# EAGLE schematic odrb (EAGLE 9.6.0)
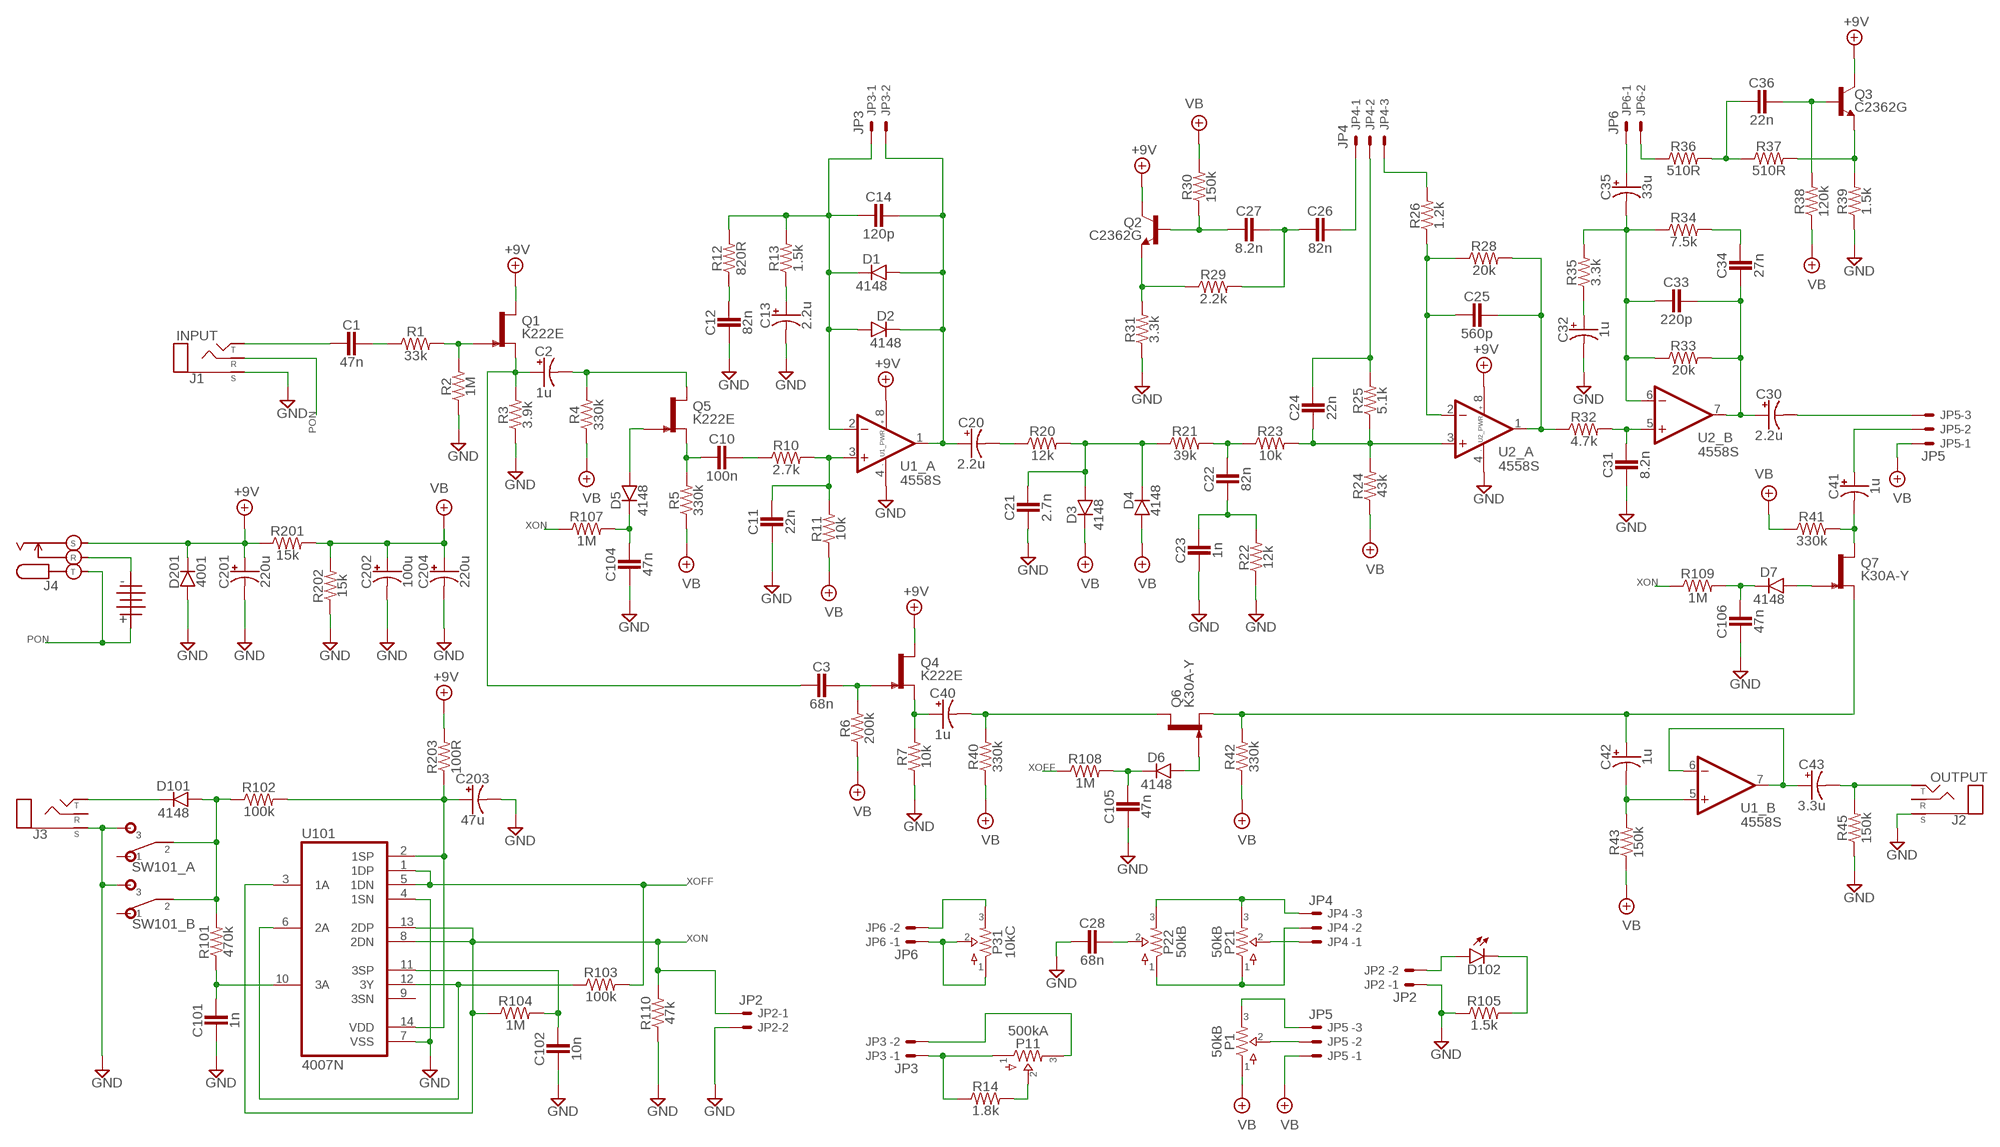
[diagram p0: schematic, sheet 1]

## Parts
1  BATTERY  [TWO_PADS]
C1  47n  CER/FILMBOX.1  [BOX_SMALL]
C2  1u  0400  [040_020]
C3  68n  CER/FILMBOX.1  [BOX_SMALL]
C10  100n  CER/FILMBOX.1  [BOX_SMALL]
C11  22n  CER/FILMBOX.1  [BOX_SMALL]
C12  82n  CER/FILMBOX.1  [BOX_SMALL]
C13  2.2u  0400  [040_020]
C14  120p  CER/FILMBOX.1  [BOX_SMALL]
C20  2.2u  0400  [040_020]
C21  2.7n  CER/FILMBOX.1  [BOX_SMALL]
C22  82n  CER/FILMBOX.1  [BOX_SMALL]
C23  1n  CER/FILMBOX.1  [BOX_SMALL]
C24  22n  CER/FILMBOX.1  [BOX_SMALL]
C25  560p  CER/FILMBOX.1  [BOX_SMALL]
C26  82n  CER/FILMBOX.1  [BOX_SMALL]
C27  8.2n  CER/FILMBOX.1  [BOX_SMALL]
C28  68n  CER/FILMBOX.1  [BOX_SMALL]
C30  2.2u  0400  [040_020]
C31  8.2n  CER/FILMBOX.1  [BOX_SMALL]
C32  1u  0400  [040_020]
C33  220p  CER/FILMBOX.1  [BOX_SMALL]
C34  27n  CER/FILMBOX.1  [BOX_SMALL]
C35  33u  0400  [040_020]
C36  22n  CER/FILMBOX.1  [BOX_SMALL]
C40  1u  0400  [040_020]
C41  1u  0400  [040_020]
C42  1u  0400  [040_020]
C43  3.3u  0400  [040_020]
C101  1n  CER/FILMBOX.1  [BOX_SMALL]
C102  10n  CER/FILMBOX.1  [BOX_SMALL]
C104  47n  CER/FILMBOX.1  [BOX_SMALL]
C105  47n  CER/FILMBOX.1  [BOX_SMALL]
C106  47n  CER/FILMBOX.1  [BOX_SMALL]
C201  220u  0400  [040_020]
C202  100u  0400  [040_020]
C203  47u  0400  [040_020]
C204  220u  0400  [040_020]
D1  4148  DO35.2  [DO35-2]
D2  4148  DO35.2  [DO35-2]
D3  4148  DO35.2  [DO35-2]
D4  4148  DO35.2  [DO35-2]
D5  4148  DO35.2  [DO35-2]
D6  4148  DO35.2  [DO35-2]
D7  4148  DO35.2  [DO35-2]
D101  4148  DO35.2  [DO35-2]
D102  LED  [3MM_D]
D201  4001  DO35.2  [DO35-2]
J1  INPUT  STEREO3PADS  [THREEPADS]
J2  OUTPUT  STEREO3PADS  [THREEPADS]
J3  STEREO3PADS  [THREEPADS]
J4  POWER  DC_KOBICONN  [DC_KOBICONN]
JP2  JP2  JST-XH-02-PIN-LONG-PAD  [JST-XH-02-PACKAGE-LONG-PAD]
JP2   JP2  JST-XH-02-PIN-LONG-PAD  [JST-XH-02-PACKAGE-LONG-PAD]
JP3  JP3  JST-XH-02-PIN-LONG-PAD  [JST-XH-02-PACKAGE-LONG-PAD]
JP3   JP3  JST-XH-02-PIN-LONG-PAD  [JST-XH-02-PACKAGE-LONG-PAD]
JP4  JP4  JST-XH-03-PIN-LONG-PAD  [JST-XH-03-PACKAGE-LONG-PAD]
JP4   JP4  JST-XH-03-PIN-LONG-PAD  [JST-XH-03-PACKAGE-LONG-PAD]
JP5  JP5  JST-XH-03-PIN-LONG-PAD  [JST-XH-03-PACKAGE-LONG-PAD]
JP5   JP5  JST-XH-03-PIN-LONG-PAD  [JST-XH-03-PACKAGE-LONG-PAD]
JP6  JP6  JST-XH-02-PIN-LONG-PAD  [JST-XH-02-PACKAGE-LONG-PAD]
JP6   JP6  JST-XH-02-PIN-LONG-PAD  [JST-XH-02-PACKAGE-LONG-PAD]
P1  50kB  POTS16MM  [16MM]
P11  500kA  POTS16MM  [16MM]
P21  50kB  POTS16MM  [16MM]
P22  50kB  POTS16MM  [16MM]
P31  10kC  POTS16MM  [16MM]
Q1  K222E  2N3819TO-92S  [TO92-]
Q2  C2362G  2N3904  [TO92-]
Q3  C2362G  2N3904  [TO92-]
Q4  K222E  2N3819TO-92S  [TO92-]
Q5  K222E  2N3819TO-92S  [TO92-]
Q6  K30A-Y  2N3819TO-92S  [TO92-]
Q7  K30A-Y  2N3819TO-92S  [TO92-]
R1  33k  R_.3B  [R0207/3]
R2  1M  R_.3B  [R0207/3]
R3  3.9k  R_.3B  [R0207/3]
R4  330k  R_.3B  [R0207/3]
R5  330k  R_.3B  [R0207/3]
R6  200k  R_.3B  [R0207/3]
R7  10k  R_.3B  [R0207/3]
R10  2.7k  R_.3B  [R0207/3]
R11  10k  R_.3B  [R0207/3]
R12  820R  R_.3B  [R0207/3]
R13  1.5k  R_.3B  [R0207/3]
R14  1.8k  R_.3B  [R0207/3]
R20  12k  R_.3B  [R0207/3]
R21  39k  R_.3B  [R0207/3]
R22  12k  R_.3B  [R0207/3]
R23  10k  R_.3B  [R0207/3]
R24  43k  R_.3B  [R0207/3]
R25  5.1k  R_.3B  [R0207/3]
R26  1.2k  R_.3B  [R0207/3]
R28  20k  R_.3B  [R0207/3]
R29  2.2k  R_.3B  [R0207/3]
R30  150k  R_.3B  [R0207/3]
R31  3.3k  R_.3B  [R0207/3]
R32  4.7k  R_.3B  [R0207/3]
R33  20k  R_.3B  [R0207/3]
R34  7.5k  R_.3B  [R0207/3]
R35  3.3k  R_.3B  [R0207/3]
R36  510R  R_.3B  [R0207/3]
R37  510R  R_.3B  [R0207/3]
R38  120k  R_.3B  [R0207/3]
R39  1.5k  R_.3B  [R0207/3]
R40  330k  R_.3B  [R0207/3]
R41  330k  R_.3B  [R0207/3]
R42  330k  R_.3B  [R0207/3]
R43  150k  R_.3B  [R0207/3]
R45  150k  R_.3B  [R0207/3]
R101  470k  R_.3B  [R0207/3]
R102  100k  R_.3B  [R0207/3]
R103  100k  R_.3B  [R0207/3]
R104  1M  R_.3B  [R0207/3]
R105  1.5k  R_.3B  [R0207/3]
R107  1M  R_.3B  [R0207/3]
R108  1M  R_.3B  [R0207/3]
R109  1M  R_.3B  [R0207/3]
R110  47k  R_.3B  [R0207/3]
R201  15k  R_.3B  [R0207/3]
R202  15k  R_.3B  [R0207/3]
R203  100R  R_.3B  [R0207/3]
SW101  DPDT  [DPDT]
U1  4558S  DUALTH  [DIL0]
U2  4558S  DUALTH  [DIL0]
U101  4007N  [DIL14]

## Nets
+9V: C201.+ D201.C J4.S Q1.3(D) Q2.1(C) Q3.1(C) Q4.3(D) R201.1 R203.2 U1.8(_PWR:V+) U2.8(_PWR:V+)
GND: C11.2 C12.2 C13.- C21.2 C23.2 C28.2 C31.2 C32.- C101.2 C102.2 C104.2 C105.2 C106.2 C201.- C202.- C203.- C204.- D201.A J1.SLEEVE(S) J2.SLEEVE(S) J3.SLEEVE(S) JP2.2 JP2 .1 R2.1 R3.1 R7.1 R22.1 R31.1 R39.1 R45.1 R105.1 R110.1 R202.1 SW101.A3 SW101.B3 U1.4(_PWR:V-) U2.4(_PWR:V-) U101.4(1SN) U101.7(VSS)
N$1: C1.2 J1.TIP(T)
N$2: C26.1 JP4.1
N$3: Q1.2(G) R1.2 R2.2
N$4: C2.+ C3.2 Q1.1(S) R3.2
N$5: C2.- Q5.3(D) R4.2
N$6: D5.A Q5.2(G)
N$7: C104.1 D5.C R107.2
N$8: C10.2 Q5.1(S) R5.2
N$9: C10.1 R10.1
N$10: C11.1 R10.2 R11.2 U1.3(_A:+IN)
N$11: C3.1 Q4.2(G) R6.2
N$12: C40.+ Q4.1(S) R7.2
N$13: C1.1 R1.1
N$14: C13.+ R13.1
N$15: C12.1 R12.1
N$16: C20.- R20.1
N$17: C21.1 D3.A D4.C R20.2 R21.1
N$18: C22.2 C23.1 R22.2
N$19: C22.1 R21.2 R23.1
N$20: C24.2 R23.2 R24.2 R25.1 U2.3(_A:+IN)
N$21: JP4.3 R26.2
N$22: C25.2 R26.1 R28.1 U2.2(_A:-IN)
N$23: C25.1 R28.2 R32.1 U2.1(_A:OUT)
N$24: C31.1 R32.2 U2.5(_B:+IN)
N$25: C33.2 C35.- R33.1 R34.1 R35.2 U2.6(_B:-IN)
N$26: C34.1 R34.2
N$27: 1.S J4.R
N$28: C35.+ JP6.1
N$29: C30.+ C33.1 C34.2 R33.2 U2.7(_B:OUT)
N$30: C24.1 JP4.2 R25.2
N$31: C32.+ R35.1
N$32: Q2.3(E) R29.1 R31.2
N$33: C27.2 Q2.2(B) R30.1
N$34: C26.2 C27.1 R29.2
N$35: C40.- Q6.3(D) R40.2
N$36: C14.1 C20.+ D1.A D2.C JP3.2 U1.1(_A:OUT)
N$37: JP6.2 R36.1
N$38: C14.2 D1.C D2.A JP3.1 R12.2 R13.2 U1.2(_A:-IN)
N$39: C30.- JP5.3
N$40: D6.A Q6.2(G)
N$41: C105.1 D6.C R108.2
N$42: C42.+ Q6.1(S) Q7.1(S) R42.2
N$43: C41.- Q7.3(D) R41.2
N$44: C41.+ JP5.2
N$45: D7.A Q7.2(G)
N$46: C106.1 D7.C R109.2
N$47: C42.- R43.2 U1.5(_B:+IN)
N$48: C43.+ U1.6(_B:-IN) U1.7(_B:OUT)
N$49: C43.- J2.TIP(T) R45.2
N$50: C36.2 R36.2 R37.1
N$51: C203.+ R102.2 R203.1 U101.2(1SP) U101.14(VDD)
N$52: Q3.3(E) R37.2 R39.2
N$53: R103.1 U101.6(2A) U101.12(3Y)
N$54: C102.1 R104.2 U101.11(3SP)
N$55: D101.C J3.TIP(T)
N$56: D101.A R101.2 R102.1 SW101.A2 SW101.B2
N$57: C101.1 R101.1 U101.10(3A)
N$58: C36.1 Q3.2(B) R38.2
N$59: JP6 .1 P31.1 P31.2
N$60: JP6 .2 P31.3
N$61: JP3 .1 P11.1 R14.1
N$62: P11.2 R14.2
N$63: JP3 .2 P11.3
N$64: C28.1 P22.2
N$65: JP4 .2 P21.1 P22.1
N$66: JP4 .1 P21.2
N$67: JP4 .3 P21.3 P22.3
N$68: JP5 .3 P1.3
N$69: JP5 .2 P1.2
N$70: D102.ANODE(A) JP2 .2
N$71: D102.P$1(C) R105.2
PON: 1.T J1.RING(R) J4.T
VB: C202.+ C204.+ D3.C D4.A JP5.1 JP5 .1 P1.1 R4.1 R5.1 R6.1 R11.1 R24.1 R30.2 R38.1 R40.1 R41.1 R42.1 R43.1 R201.2 R202.2
XOFF: R103.2 R108.1 U101.1(1DP) U101.5(1DN)
XON: JP2.1 R104.1 R107.1 R109.1 R110.2 U101.3(1A) U101.8(2DN) U101.13(2DP)
Unconnected: J2.RING(R) J3.RING(R) SW101.A1 SW101.B1 U101.9(3SN)

## Library data of the parts
1 = pedals-jacks:BATTERY
C1 C3 C10-C12 C14 C21-C28 C31 C33 C34 C36 C101 C102 C104-C106 = pedals-capacitors-film:CER/FILM: 47 - 120pF Xicon Ceramic Disc 2.5mm lead spacing
C2 C13 C20 C30 C32 C35 C40-C43 C201-C204 = pedals-capacitors-elec:040
D1-D7 D101 D201 = pedals-diodes:DO35: DO-35 Package Diodes: 1N914
D102 = pedals-diodes:LED
J1-J3 = pedals-jacks:STEREO
J4 = pedals-jacks:DC_KOBICONN
JP2 JP2  JP3 JP3  JP6 JP6  = pedals-headers:JST-XH-02-PIN: JST XH Connector 2 Pin Wire to board connector. Pitch: 2,54 mm, (0.100") Number of pins: 2 Created by Rembrandt Electronics www.rembrandtelectronics.com
JP4 JP4  JP5 JP5  = pedals-headers:JST-XH-03-PIN: JST XH Connector 2 Pin Wire to board connector. Pitch: 2,54 mm, (0.100") Number of pins: 3 Created by Rembrandt Electronics www.rembrandtelectronics.com
P1 P11 P21 P22 P31 = pedals-potentiometers:POTS
Q1 Q4-Q7 = pedals-transistors:2N3819: N-CHANNEL FET
Q2 Q3 = pedals-transistors:2N3904: NPN Transistor
R1-R7 R10-R14 R20-R26 R28-R43 R45 R101-R105 R107-R110 R201-R203 = pedals-resistors:R_
SW101 = pedals-switches:DPDT
U1 U2 = pedals-integrated circuits:DUAL: OP AMP
U101 = 40xx:4007: Dual COMPLIMENTARY PAIR plus INVERTER